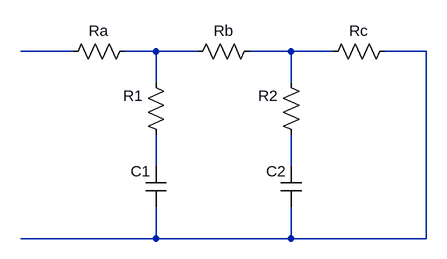
[diagram p0: schematic TS11_Ejercicio_1_LTSpice.asc]
TS11_Ejercicio_1_LTSpice.asc, the LTspice schematic file:
Version 4
SHEET 1 880 680
WIRE 0 96 -80 96
WIRE 128 96 80 96
WIRE 192 96 128 96
WIRE 336 96 272 96
WIRE 400 96 336 96
WIRE 544 96 480 96
WIRE 128 144 128 96
WIRE 336 144 336 96
WIRE 128 272 128 224
WIRE 336 272 336 224
WIRE 128 384 128 336
WIRE 128 384 -80 384
WIRE 336 384 336 336
WIRE 336 384 128 384
WIRE 544 384 544 96
WIRE 544 384 336 384
SYMBOL res 96 80 R90
WINDOW 0 0 56 VBottom 2
WINDOW 3 32 56 VTop 2
SYMATTR InstName Ra
SYMATTR Value ""
SYMBOL res 288 80 R90
WINDOW 0 0 56 VBottom 2
WINDOW 3 32 56 VTop 2
SYMATTR InstName Rb
SYMATTR Value ""
SYMBOL res 496 80 R90
WINDOW 0 0 56 VBottom 2
WINDOW 3 32 56 VTop 2
SYMATTR InstName Rc
SYMATTR Value ""
SYMBOL res 144 240 R180
WINDOW 0 36 76 Left 2
WINDOW 3 36 40 Left 2
SYMATTR InstName R1
SYMATTR Value ""
SYMBOL res 352 240 R180
WINDOW 0 36 76 Left 2
WINDOW 3 36 40 Left 2
SYMATTR InstName R2
SYMATTR Value ""
SYMBOL cap 144 272 M0
SYMATTR InstName C1
SYMATTR Value ""
SYMBOL cap 352 272 M0
SYMATTR InstName C2
SYMATTR Value ""

The netlist it stands for:
* TS11_Ejercicio_1_LTSpice.asc
Ra N002 N001
Rb N003 N002
Rc N004 N003
R1 N005 N002
R2 N006 N003
C1 N005 N004
C2 N006 N004
.backanno
.end